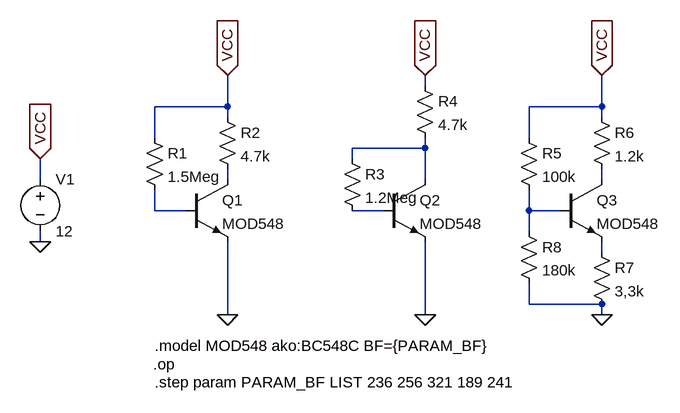
[diagram p0: schematic v2_CircuitoQuintaParte.asc]
v2_CircuitoQuintaParte.asc, the LTspice schematic file:
Version 4
SHEET 1 880 680
WIRE 416 0 416 -16
WIRE 112 32 112 -16
WIRE 112 32 0 32
WIRE 688 32 688 -16
WIRE 688 32 576 32
WIRE 112 48 112 32
WIRE 688 48 688 32
WIRE 0 80 0 32
WIRE 576 80 576 32
WIRE 416 96 416 80
WIRE 416 96 304 96
WIRE 304 112 304 96
WIRE -176 144 -176 112
WIRE 112 144 112 128
WIRE 416 144 416 96
WIRE 688 144 688 128
WIRE 0 192 0 160
WIRE 48 192 0 192
WIRE 352 192 304 192
WIRE 576 192 576 160
WIRE 624 192 576 192
WIRE 576 224 576 192
WIRE -176 240 -176 224
WIRE 688 256 688 240
WIRE 576 336 576 304
WIRE 688 336 576 336
WIRE 112 352 112 240
WIRE 416 352 416 240
WIRE 688 352 688 336
FLAG 112 352 0
FLAG 112 -16 VCC
IOPIN 112 -16 In
FLAG 416 352 0
FLAG 416 -16 VCC
IOPIN 416 -16 In
FLAG 688 352 0
FLAG 688 -16 VCC
IOPIN 688 -16 In
FLAG -176 112 VCC
IOPIN -176 112 In
FLAG -176 240 0
SYMBOL npn 48 144 R0
SYMATTR InstName Q1
SYMATTR Value MOD548
SYMBOL res -16 64 R0
SYMATTR InstName R1
SYMATTR Value 1.5Meg
SYMBOL res 96 32 R0
SYMATTR InstName R2
SYMATTR Value 4.7k
SYMBOL npn 352 144 R0
SYMATTR InstName Q2
SYMATTR Value MOD548
SYMBOL res 288 96 R0
SYMATTR InstName R3
SYMATTR Value 1.2Meg
SYMBOL res 400 -16 R0
SYMATTR InstName R4
SYMATTR Value 4.7k
SYMBOL npn 624 144 R0
SYMATTR InstName Q3
SYMATTR Value MOD548
SYMBOL res 560 64 R0
SYMATTR InstName R5
SYMATTR Value 100k
SYMBOL res 672 32 R0
SYMATTR InstName R6
SYMATTR Value 1.2k
SYMBOL res 672 240 R0
SYMATTR InstName R7
SYMATTR Value 3,3k
SYMBOL res 560 208 R0
SYMATTR InstName R8
SYMATTR Value 180k
SYMBOL voltage -176 128 R0
WINDOW 123 0 0 Left 0
WINDOW 39 0 0 Left 0
SYMATTR InstName V1
SYMATTR Value 12
TEXT 0 400 Left 2 !.model MOD548 ako:BC548C BF={PARAM_BF}
TEXT -2 428 Left 2 !.op
TEXT 0 456 Left 2 !.step param PARAM_BF LIST 236 256 321 189 241

The netlist it stands for:
* v2_CircuitoQuintaParte.asc
Q1 N002 N004 0 0 MOD548
R1 VCC N004 1.5Meg
R2 VCC N002 4.7k
Q2 N001 N005 0 0 MOD548
R3 N001 N005 1.2Meg
R4 VCC N001 4.7k
Q3 N003 N006 N007 0 MOD548
R5 VCC N006 100k
R6 VCC N003 1.2k
R7 N007 0 3,3k
R8 N006 0 180k
V1 VCC 0 12
.model NPN NPN
.model PNP PNP
.lib standard.bjt
.model MOD548 ako:BC548C BF={PARAM_BF}
.op
.step param PARAM_BF LIST 236 256 321 189 241
.backanno
.end